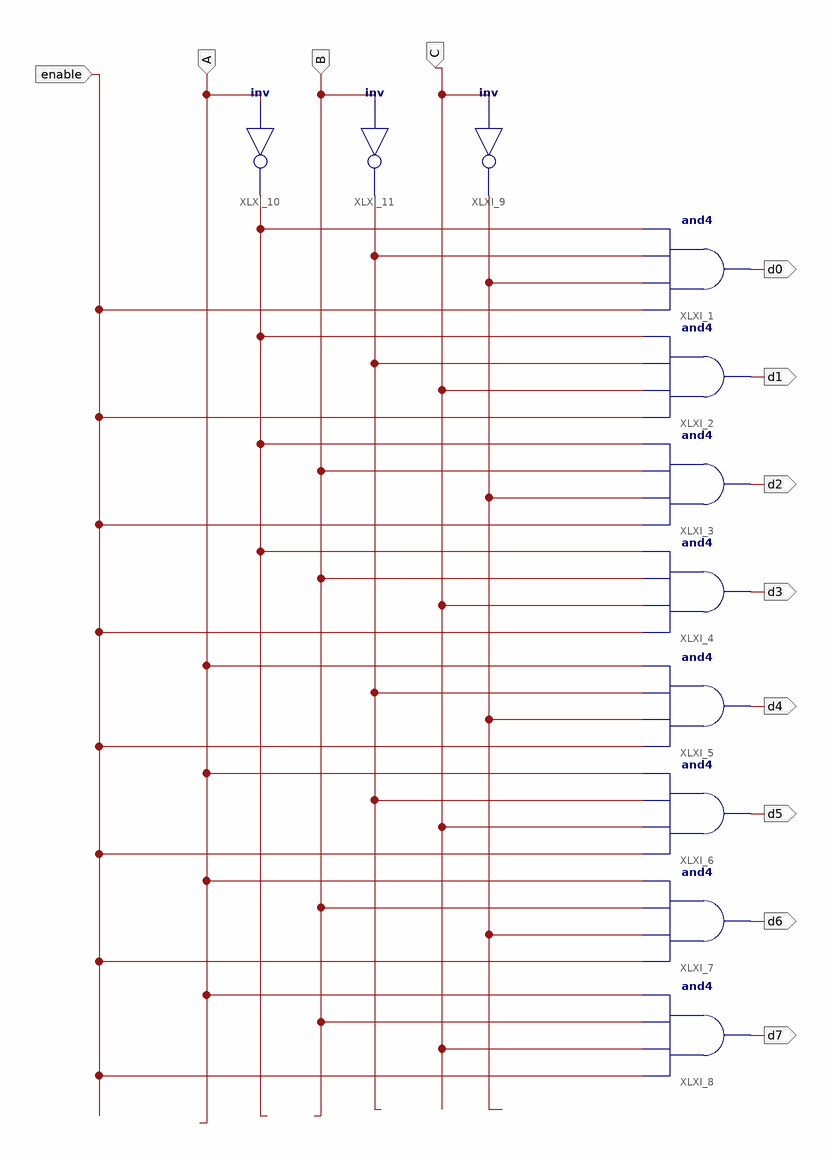
[diagram p0: schematic sheet 1]
// Xilinx ISE schematic sprinkler_circuit.sch (spartan3e) as structural Verilog: 11 symbols, 12 ports
module sprinkler_circuit (
  input  B,
  input  C,
  input  enable,
  input  A,
  output d0,
  output d1,
  output d2,
  output d3,
  output d4,
  output d5,
  output d6,
  output d7
);

  wire XLXN_1, XLXN_2, XLXN_4;

  and XLXI_1 (d0, enable, XLXN_2, XLXN_4, XLXN_1);
  and XLXI_2 (d1, enable, C, XLXN_4, XLXN_1);
  and XLXI_3 (d2, enable, XLXN_2, B, XLXN_1);
  and XLXI_4 (d3, enable, C, B, XLXN_1);
  and XLXI_5 (d4, enable, XLXN_2, XLXN_4, A);
  and XLXI_6 (d5, enable, C, XLXN_4, A);
  and XLXI_7 (d6, enable, XLXN_2, B, A);
  and XLXI_8 (d7, enable, C, B, A);
  not XLXI_9 (XLXN_2, C);
  not XLXI_10 (XLXN_1, A);
  not XLXI_11 (XLXN_4, B);
endmodule
